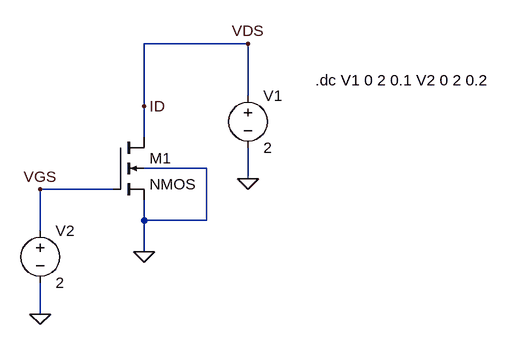
[diagram p0: schematic Draft5.asc]
Draft5.asc, the LTspice schematic file:
Version 4.1
SHEET 1 880 680
WIRE 320 -48 160 -48
WIRE 320 32 320 -48
WIRE 160 48 160 -48
WIRE 160 96 160 48
WIRE 256 144 160 144
WIRE 320 160 320 112
WIRE 112 176 0 176
WIRE 160 224 160 192
WIRE 256 224 256 144
WIRE 256 224 160 224
WIRE 0 240 0 176
WIRE 160 272 160 224
WIRE 0 368 0 320
FLAG 0 368 0
FLAG 160 272 0
FLAG 320 160 0
FLAG 320 -48 VDS
FLAG 160 48 ID
FLAG 0 176 VGS
SYMBOL nmos4 112 96 R0
SYMATTR InstName M1
SYMATTR Value2 l=1000nm w=1000nm
SYMBOL voltage 320 16 R0
WINDOW 123 0 0 Left 0
WINDOW 39 0 0 Left 0
SYMATTR InstName V1
SYMATTR Value 2
SYMBOL voltage 0 224 R0
WINDOW 123 0 0 Left 0
WINDOW 39 0 0 Left 0
SYMATTR InstName V2
SYMATTR Value 2
TEXT 424 8 Left 2 !.dc V1 0 2 0.1 V2 0 2 0.2

The netlist it stands for:
* Draft5.asc
M1 ID VGS 0 0 NMOS l=1000nm w=1000nm
V1 ID 0 2
V2 VGS 0 2
.model NMOS NMOS
.model PMOS PMOS
.lib standard.mos
.dc V1 0 2 0.1 V2 0 2 0.2
.backanno
.end